# EAGLE schematic Power (EAGLE 6.4)
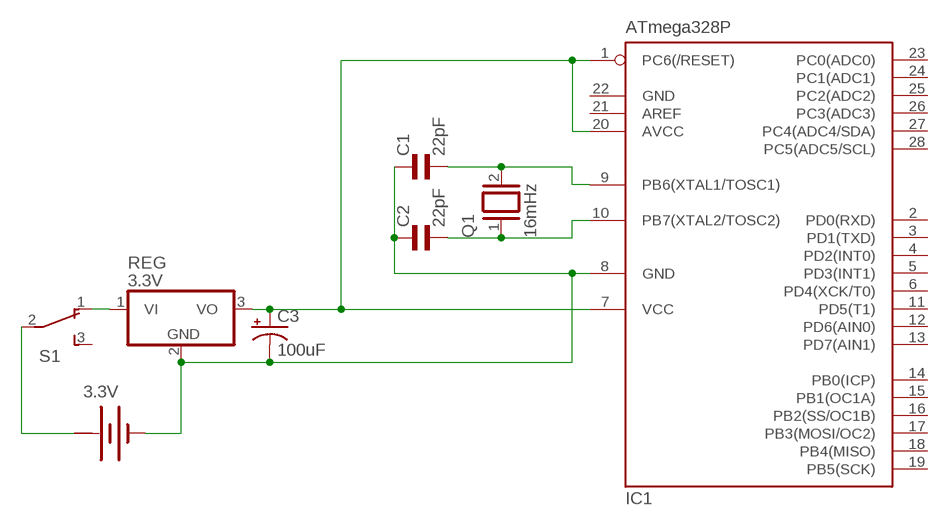
[diagram p0: schematic, sheet 1]

## Parts
3.3V  BATTERY  [BATTERY]
C1  22pF  EL-BI25-10AXIAL  [EU25-10]
C2  22pF  EL-BI25-10AXIAL  [EU25-10]
C3  100uF  CPOL-US085CS-1AR  [085CS_1AR]
IC1  ATmega328P  MEGA8-P  [DIL28-3]
Q1  16mHz  XTAL  [Q]
REG  3.3V  LM340H-05  [TO220H]
S1  TL36PO  [TL3XPO]

## Nets
N$1: 3.3V.- C1.1 C2.1 C3.- IC1.8(GND) REG.2(GND)
N$2: 3.3V.+ S1.2(P)
N$3: C3.+ IC1.1(PC6(/RESET)) IC1.7(VCC) IC1.20(AVCC) REG.3(VO)
N$4: C1.2 IC1.9(PB6(XTAL1/TOSC1)) Q1.2
N$5: C2.2 IC1.10(PB7(XTAL2/TOSC2)) Q1.1
N$7: REG.1(VI) S1.1(O)
Unconnected: IC1.2(PD0(RXD)) IC1.3(PD1(TXD)) IC1.4(PD2(INT0)) IC1.5(PD3(INT1)) IC1.6(PD4(XCK/T0)) IC1.11(PD5(T1)) IC1.12(PD6(AIN0)) IC1.13(PD7(AIN1)) IC1.14(PB0(ICP)) IC1.15(PB1(OC1A)) IC1.16(PB2(SS/OC1B)) IC1.17(PB3(MOSI/OC2)) IC1.18(PB4(MISO)) IC1.19(PB5(SCK)) IC1.21(AREF) IC1.23(PC0(ADC0)) IC1.24(PC1(ADC1)) IC1.25(PC2(ADC2)) IC1.26(PC3(ADC3)) IC1.27(PC4(ADC4/SDA)) IC1.28(PC5(ADC5/SCL)) S1.3(S)

## Power pins joined to a net without a drawn wire
+: 3.3V.+@1(+)
GND: IC1.22(GND)

## Library data of the parts
3.3V = special:BATTERY: BATTERY
C1 C2 = resistor:EL-: BIPOLAR ELECTROLYTIC CAPACITOR
C3 = resistor:CPOL-US: POLARIZED CAPACITOR, American symbol
IC1 = atmel:MEGA8-P: MICROCONTROLLER 8 Kbytes FLASH, 1 kbytes SRAM, 512 bytes EEPROM, USART, 4-channel 10 bit ADC, 2-channel 8 bit ADC Pin compatible with Atmega48, ATMega88, ATMega168 Source: avr.lbr; OC_FARNELL: unknown; OC_NEWARK: unknown
Q1 = special:XTAL: CRYSTAL
REG = linear:LM340?-*: Positive VOLTAGE REGULATOR Source: http://cache.national.com/ds/LM/LM340.pdf
S1 = switch:TL36PO: TINY SWITCH ON - ON Source: http://www2.produktinfo.conrad.com/datenblaetter/700000-724999/705152-da-01-de-Subminiaturschalter_TL_36YO.pdf